# Altium schematic sheet bms-interface_interface.SchDoc: foxBMS BMS-Master
size A3; DocumentNumber: 21; SheetNumber: 21; SheetTotal: 24; Author: Fraunhofer IISB foxBMS Team; REL-DATE: 2017-05-16; VERSION: 1.0.2; SheetDescription: Interface to BMS-Interface
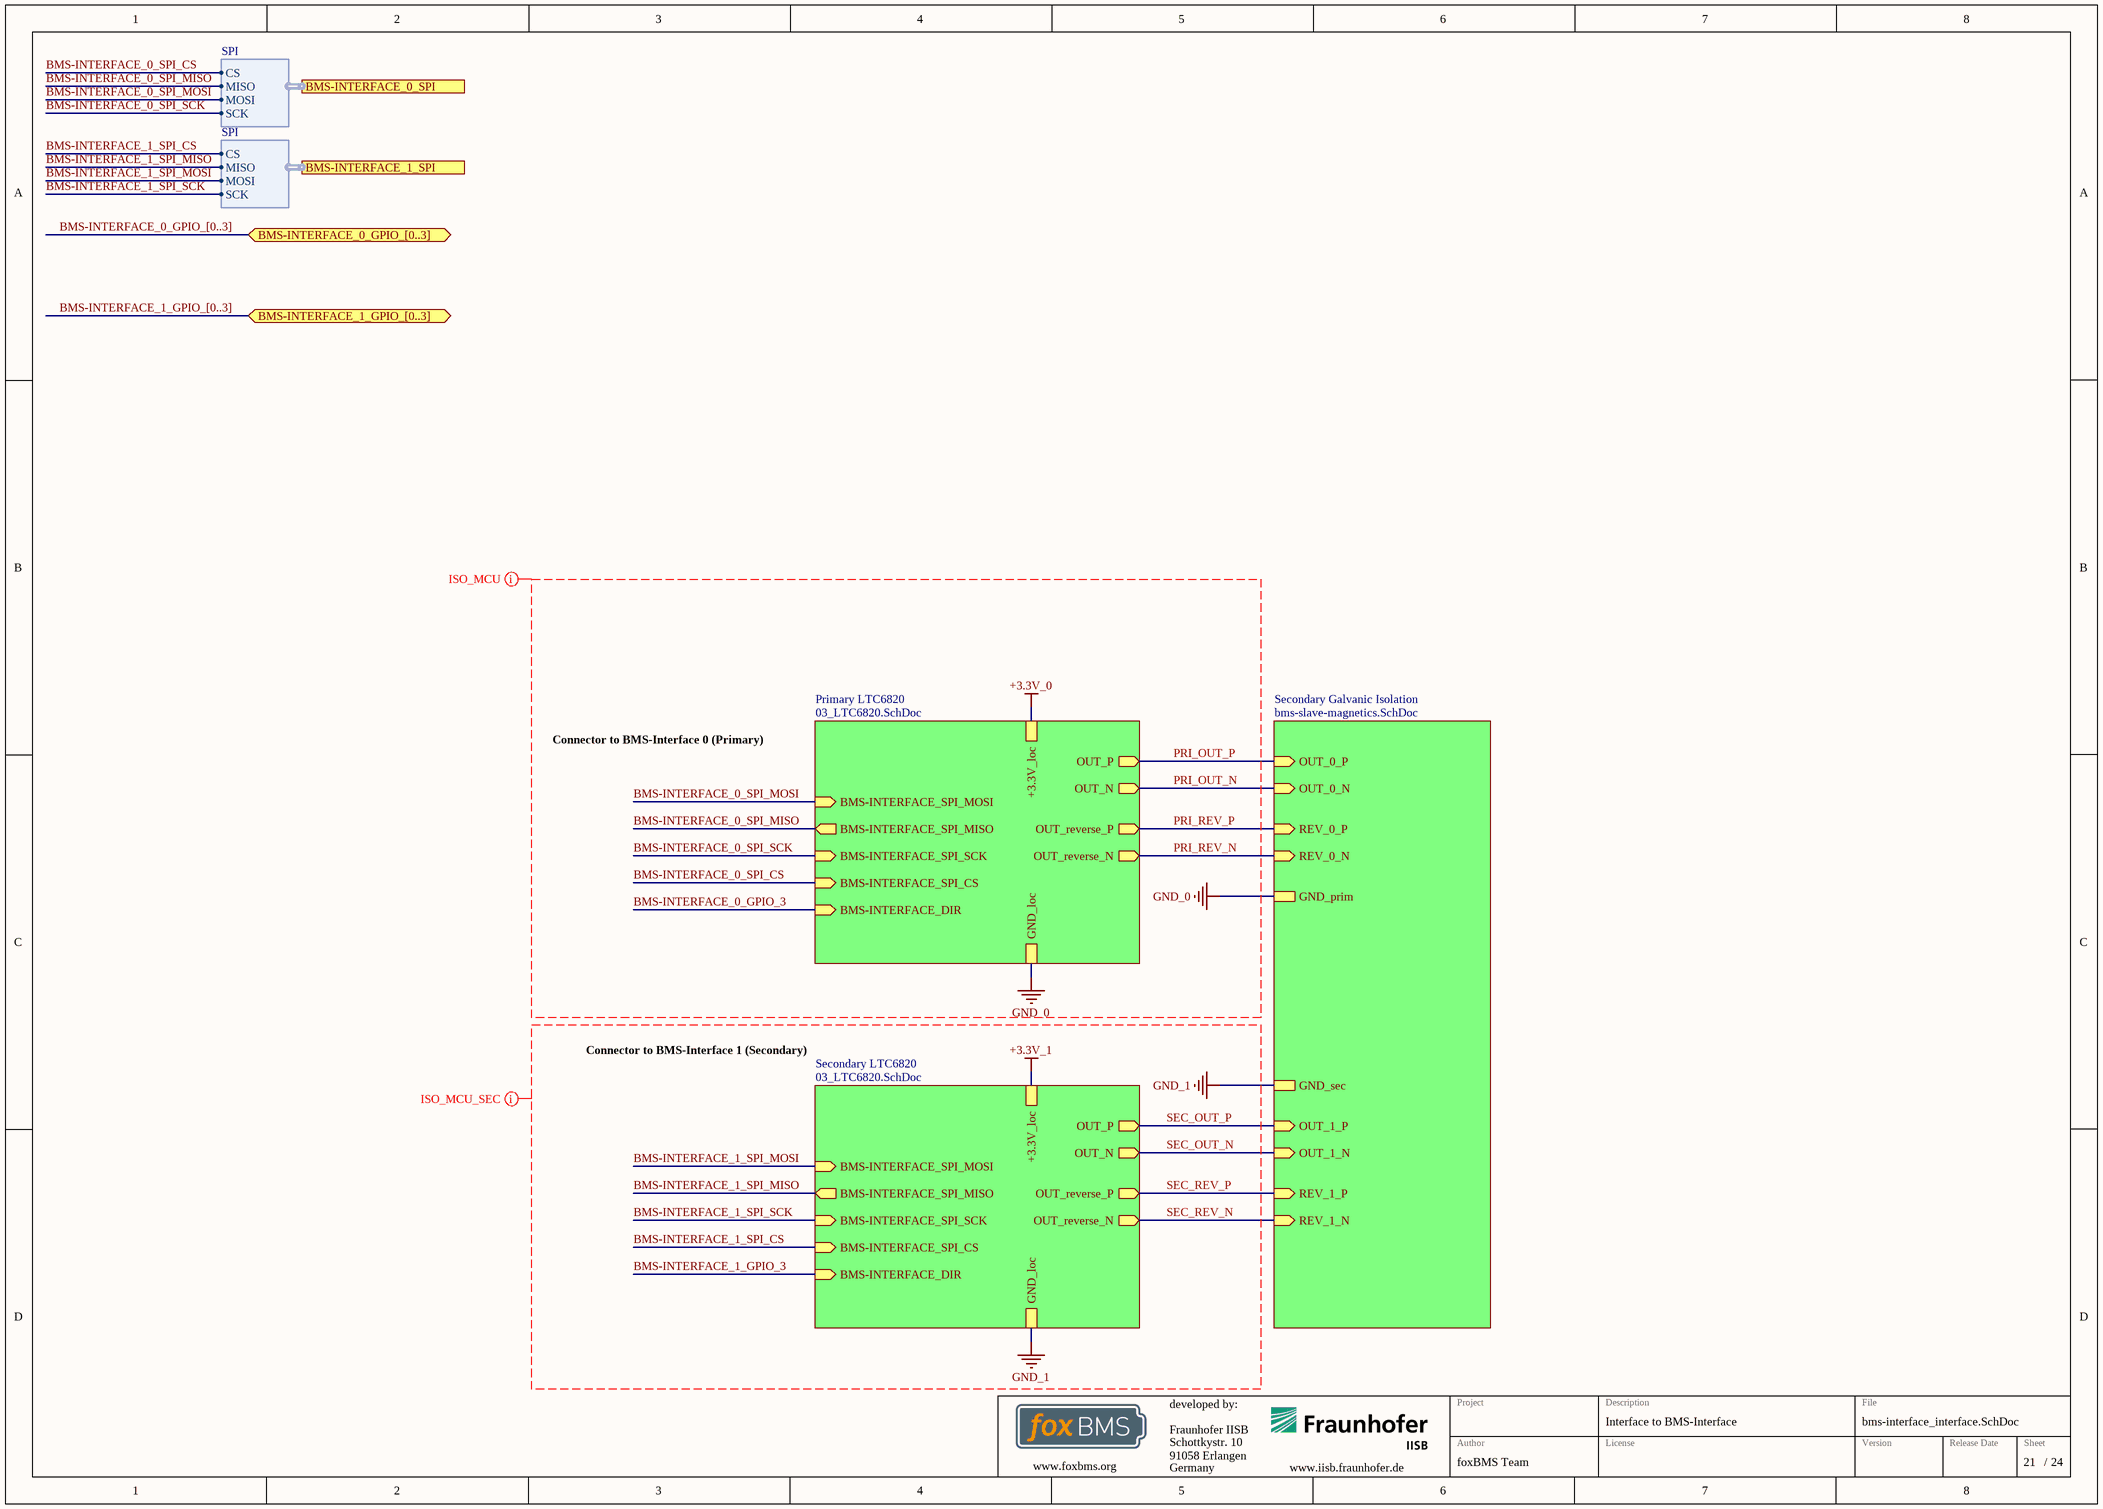
[diagram p0: bms-interface_interface.SchDoc]

## Sub-sheets
Primary LTC6820 = 03_LTC6820.SchDoc: BMS-INTERFACE_SPI_CS (in), BMS-INTERFACE_SPI_SCK (in), BMS-INTERFACE_SPI_MOSI (in), BMS-INTERFACE_SPI_MISO (out), OUT_P (out), OUT_N (out), +3.3V_loc, GND_loc, OUT_reverse_P (out), OUT_reverse_N (out), BMS-INTERFACE_DIR (in)
Secondary Galvanic Isolation = bms-slave-magnetics.SchDoc: REV_0_N (in), OUT_0_P (in), OUT_1_N (in), OUT_0_N (in), REV_1_N (in), REV_1_P (in), REV_0_P (in), OUT_1_P (in), GND_prim, GND_sec
Secondary LTC6820 = 03_LTC6820.SchDoc: BMS-INTERFACE_SPI_CS (in), BMS-INTERFACE_SPI_MOSI (in), BMS-INTERFACE_SPI_MISO (out), BMS-INTERFACE_SPI_SCK (in), OUT_N (out), OUT_P (out), +3.3V_loc, GND_loc, OUT_reverse_P (out), OUT_reverse_N (out), BMS-INTERFACE_DIR (in)

## Ports
BMS-INTERFACE_0_GPIO_[0..3] (bidir), BMS-INTERFACE_0_SPI (harness SPI), BMS-INTERFACE_1_GPIO_[0..3] (bidir), BMS-INTERFACE_1_SPI (harness SPI)

## Harnesses
SPI: CS, MISO, MOSI, SCK

## Nets
+3.3V_0: sheet Primary LTC6820/+3.3V_loc
+3.3V_1: sheet Secondary LTC6820/+3.3V_loc
GND_0: sheet Primary LTC6820/GND_loc, sheet Secondary Galvanic Isolation/GND_prim
GND_1: sheet Secondary Galvanic Isolation/GND_sec, sheet Secondary LTC6820/GND_loc
BMS-INTERFACE_0_GPIO_3: sheet Primary LTC6820/BMS-INTERFACE_DIR
BMS-INTERFACE_0_SPI_CS: sheet Primary LTC6820/BMS-INTERFACE_SPI_CS, port BMS-INTERFACE_0_SPI.CS
BMS-INTERFACE_0_SPI_MISO: sheet Primary LTC6820/BMS-INTERFACE_SPI_MISO, port BMS-INTERFACE_0_SPI.MISO
BMS-INTERFACE_0_SPI_MOSI: sheet Primary LTC6820/BMS-INTERFACE_SPI_MOSI, port BMS-INTERFACE_0_SPI.MOSI
BMS-INTERFACE_0_SPI_SCK: sheet Primary LTC6820/BMS-INTERFACE_SPI_SCK, port BMS-INTERFACE_0_SPI.SCK
BMS-INTERFACE_1_GPIO_3: sheet Secondary LTC6820/BMS-INTERFACE_DIR
BMS-INTERFACE_1_SPI_CS: sheet Secondary LTC6820/BMS-INTERFACE_SPI_CS, port BMS-INTERFACE_1_SPI.CS
BMS-INTERFACE_1_SPI_MISO: sheet Secondary LTC6820/BMS-INTERFACE_SPI_MISO, port BMS-INTERFACE_1_SPI.MISO
BMS-INTERFACE_1_SPI_MOSI: sheet Secondary LTC6820/BMS-INTERFACE_SPI_MOSI, port BMS-INTERFACE_1_SPI.MOSI
BMS-INTERFACE_1_SPI_SCK: sheet Secondary LTC6820/BMS-INTERFACE_SPI_SCK, port BMS-INTERFACE_1_SPI.SCK
PRI_OUT_N: sheet Primary LTC6820/OUT_N, sheet Secondary Galvanic Isolation/OUT_0_N
PRI_OUT_P: sheet Primary LTC6820/OUT_P, sheet Secondary Galvanic Isolation/OUT_0_P
PRI_REV_N: sheet Primary LTC6820/OUT_reverse_N, sheet Secondary Galvanic Isolation/REV_0_N
PRI_REV_P: sheet Primary LTC6820/OUT_reverse_P, sheet Secondary Galvanic Isolation/REV_0_P
SEC_OUT_N: sheet Secondary Galvanic Isolation/OUT_1_N, sheet Secondary LTC6820/OUT_N
SEC_OUT_P: sheet Secondary Galvanic Isolation/OUT_1_P, sheet Secondary LTC6820/OUT_P
SEC_REV_N: sheet Secondary Galvanic Isolation/REV_1_N, sheet Secondary LTC6820/OUT_reverse_N
SEC_REV_P: sheet Secondary Galvanic Isolation/REV_1_P, sheet Secondary LTC6820/OUT_reverse_P

## Buses and harness runs
bus BMS-INTERFACE_0_GPIO_[0..3] = port BMS-INTERFACE_0_GPIO_[0..3]
bus BMS-INTERFACE_1_GPIO_[0..3] = port BMS-INTERFACE_1_GPIO_[0..3]

## Layout directives
net class ISO_MCU: +3.3V_0, BMS-INTERFACE_0_GPIO_3, BMS-INTERFACE_0_SPI_CS, BMS-INTERFACE_0_SPI_MISO, BMS-INTERFACE_0_SPI_MOSI, BMS-INTERFACE_0_SPI_SCK, GND_0, PRI_OUT_N, PRI_OUT_P, PRI_REV_N, PRI_REV_P
net class ISO_MCU_SEC: +3.3V_1, BMS-INTERFACE_1_GPIO_3, BMS-INTERFACE_1_SPI_CS, BMS-INTERFACE_1_SPI_MISO, BMS-INTERFACE_1_SPI_MOSI, BMS-INTERFACE_1_SPI_SCK, GND_1, SEC_OUT_N, SEC_OUT_P, SEC_REV_N, SEC_REV_P

## Notes on the sheet
- Connector to BMS-Interface 0 (Primary)
- Connector to BMS-Interface 1 (Secondary)
- Fraunhofer IISB
- Schottkystr. 10
- developed by:
- 91058 Erlangen
- Germany
- Author
- Project
- License
- Description
- File
- Version
- Release Date
- Sheet
- www.foxbms.org
- www.iisb.fraunhofer.de
- foxBMS Team
- /